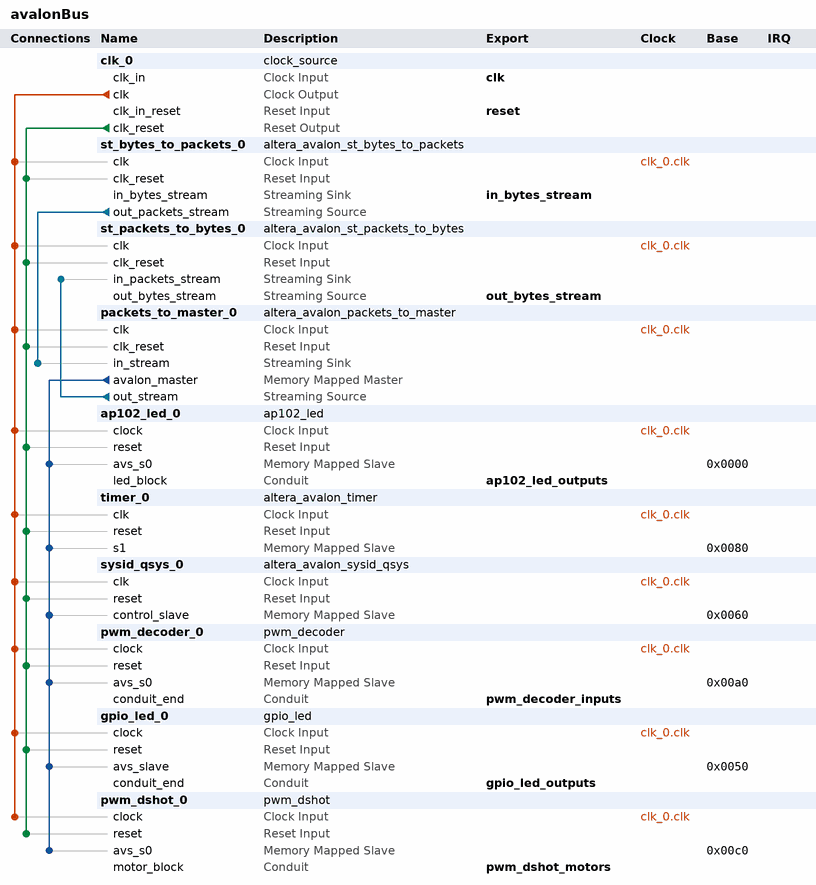
[diagram p0: system contents]
# Platform Designer (Qsys) system avalonBus, Cyclone 10 LP 10CL025YU256C8G
# Parameters at their usual value, and those the tool derives, are not listed.
package require -exact qsys 18.1
create_system avalonBus
set_project_property DEVICE_FAMILY {Cyclone 10 LP}
set_project_property DEVICE 10CL025YU256C8G

add_instance clk_0 clock_source 18.1
set_instance_parameter_value clk_0 clockFrequency 10000000

add_instance st_bytes_to_packets_0 altera_avalon_st_bytes_to_packets 18.1
set_instance_parameter_value st_bytes_to_packets_0 CHANNEL_WIDTH 8
set_instance_parameter_value st_bytes_to_packets_0 ENCODING 0

add_instance st_packets_to_bytes_0 altera_avalon_st_packets_to_bytes 18.1
set_instance_parameter_value st_packets_to_bytes_0 CHANNEL_WIDTH 8
set_instance_parameter_value st_packets_to_bytes_0 ENCODING 0

add_instance packets_to_master_0 altera_avalon_packets_to_master 18.1
set_instance_parameter_value packets_to_master_0 EXPORT_MASTER_SIGNALS 0
set_instance_parameter_value packets_to_master_0 FAST_VER 1
set_instance_parameter_value packets_to_master_0 FIFO_DEPTHS 2

add_instance ap102_led_0 ap102_led 1.0
set_instance_parameter_value ap102_led_0 number_leds 8

add_instance timer_0 altera_avalon_timer 18.1
set_instance_parameter_value timer_0 alwaysRun true
set_instance_parameter_value timer_0 period 1
set_instance_parameter_value timer_0 periodUnits USEC

add_instance sysid_qsys_0 altera_avalon_sysid_qsys 18.1
set_instance_parameter_value sysid_qsys_0 id 287454020

add_instance pwm_decoder_0 pwm_decoder 1.0
set_instance_parameter_value pwm_decoder_0 clockFrequency 10000000

add_instance gpio_led_0 gpio_led 1.1

add_instance pwm_dshot_0 pwm_dshot 1.0
set_instance_parameter_value pwm_dshot_0 motors_supported 4

# connections
add_connection clk_0.clk ap102_led_0.clock clock
add_connection clk_0.clk gpio_led_0.clock clock
add_connection clk_0.clk packets_to_master_0.clk clock
add_connection clk_0.clk pwm_decoder_0.clock clock
add_connection clk_0.clk pwm_dshot_0.clock clock
add_connection clk_0.clk st_bytes_to_packets_0.clk clock
add_connection clk_0.clk st_packets_to_bytes_0.clk clock
add_connection clk_0.clk sysid_qsys_0.clk clock
add_connection clk_0.clk timer_0.clk clock
add_connection clk_0.clk_reset ap102_led_0.reset reset
add_connection clk_0.clk_reset gpio_led_0.reset reset
add_connection clk_0.clk_reset packets_to_master_0.clk_reset reset
add_connection clk_0.clk_reset pwm_decoder_0.reset reset
add_connection clk_0.clk_reset pwm_dshot_0.reset reset
add_connection clk_0.clk_reset st_bytes_to_packets_0.clk_reset reset
add_connection clk_0.clk_reset st_packets_to_bytes_0.clk_reset reset
add_connection clk_0.clk_reset sysid_qsys_0.reset reset
add_connection clk_0.clk_reset timer_0.reset reset
add_connection packets_to_master_0.avalon_master ap102_led_0.avs_s0 avalon
set_connection_parameter_value packets_to_master_0.avalon_master/ap102_led_0.avs_s0 baseAddress 0x0000
add_connection packets_to_master_0.avalon_master gpio_led_0.avs_slave avalon
set_connection_parameter_value packets_to_master_0.avalon_master/gpio_led_0.avs_slave baseAddress 0x0050
add_connection packets_to_master_0.avalon_master pwm_decoder_0.avs_s0 avalon
set_connection_parameter_value packets_to_master_0.avalon_master/pwm_decoder_0.avs_s0 baseAddress 0x00a0
add_connection packets_to_master_0.avalon_master pwm_dshot_0.avs_s0 avalon
set_connection_parameter_value packets_to_master_0.avalon_master/pwm_dshot_0.avs_s0 baseAddress 0x00c0
add_connection packets_to_master_0.avalon_master sysid_qsys_0.control_slave avalon
set_connection_parameter_value packets_to_master_0.avalon_master/sysid_qsys_0.control_slave baseAddress 0x0060
add_connection packets_to_master_0.avalon_master timer_0.s1 avalon
set_connection_parameter_value packets_to_master_0.avalon_master/timer_0.s1 baseAddress 0x0080
add_connection packets_to_master_0.out_stream st_packets_to_bytes_0.in_packets_stream avalon_streaming
add_connection st_bytes_to_packets_0.out_packets_stream packets_to_master_0.in_stream avalon_streaming

# exported interfaces
add_interface ap102_led_outputs conduit end
set_interface_property ap102_led_outputs EXPORT_OF ap102_led_0.led_block
add_interface clk clock sink
set_interface_property clk EXPORT_OF clk_0.clk_in
add_interface gpio_led_outputs conduit end
set_interface_property gpio_led_outputs EXPORT_OF gpio_led_0.conduit_end
add_interface in_bytes_stream avalon_streaming sink
set_interface_property in_bytes_stream EXPORT_OF st_bytes_to_packets_0.in_bytes_stream
add_interface out_bytes_stream avalon_streaming source
set_interface_property out_bytes_stream EXPORT_OF st_packets_to_bytes_0.out_bytes_stream
add_interface pwm_decoder_inputs conduit end
set_interface_property pwm_decoder_inputs EXPORT_OF pwm_decoder_0.conduit_end
add_interface pwm_dshot_motors conduit end
set_interface_property pwm_dshot_motors EXPORT_OF pwm_dshot_0.motor_block
add_interface reset reset sink
set_interface_property reset EXPORT_OF clk_0.clk_in_reset

set_interconnect_requirement {$system} qsys_mm.clockCrossingAdapter HANDSHAKE
set_interconnect_requirement {$system} qsys_mm.enableEccProtection FALSE
set_interconnect_requirement {$system} qsys_mm.enableInstrumentation TRUE
set_interconnect_requirement {$system} qsys_mm.insertDefaultSlave FALSE
set_interconnect_requirement {$system} qsys_mm.maxAdditionalLatency 1
set_interconnect_requirement ap102_led_0.avs_s0 qsys_mm.insertPerformanceMonitor FALSE
set_interconnect_requirement packets_to_master_0.avalon_master qsys_mm.insertPerformanceMonitor FALSE
set_interconnect_requirement timer_0.s1 qsys_mm.insertPerformanceMonitor FALSE

save_system avalonBus.qsys
